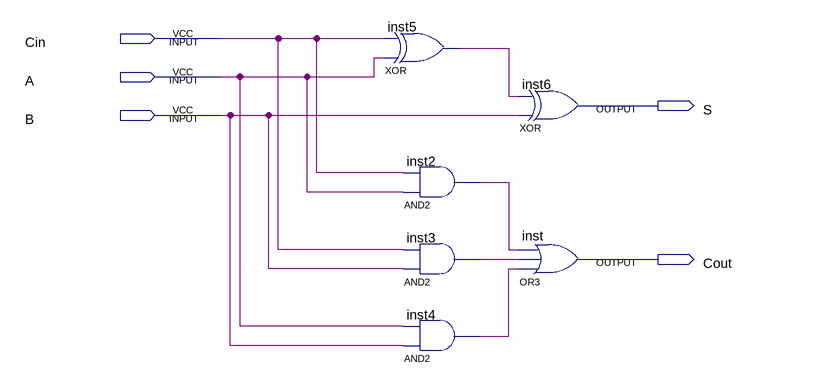
[diagram p0: schematic sheet]
// Quartus schematic sumador_completo.bdf as structural Verilog: 6 symbols, 5 pins
module sumador_completo (
  input  Cin,
  input  A,
  input  B,
  output S,
  output Cout
);

  wire inst2_out, inst3_out, inst4_out, inst5_out;

  xor inst5 (inst5_out, A, Cin);
  and inst2 (inst2_out, A, Cin);
  and inst3 (inst3_out, B, Cin);
  and inst4 (inst4_out, B, A);
  xor inst6 (S, B, inst5_out);
  or inst (Cout, inst4_out, inst3_out, inst2_out);
endmodule
